# Altium project MDBU004A.PrjPcb
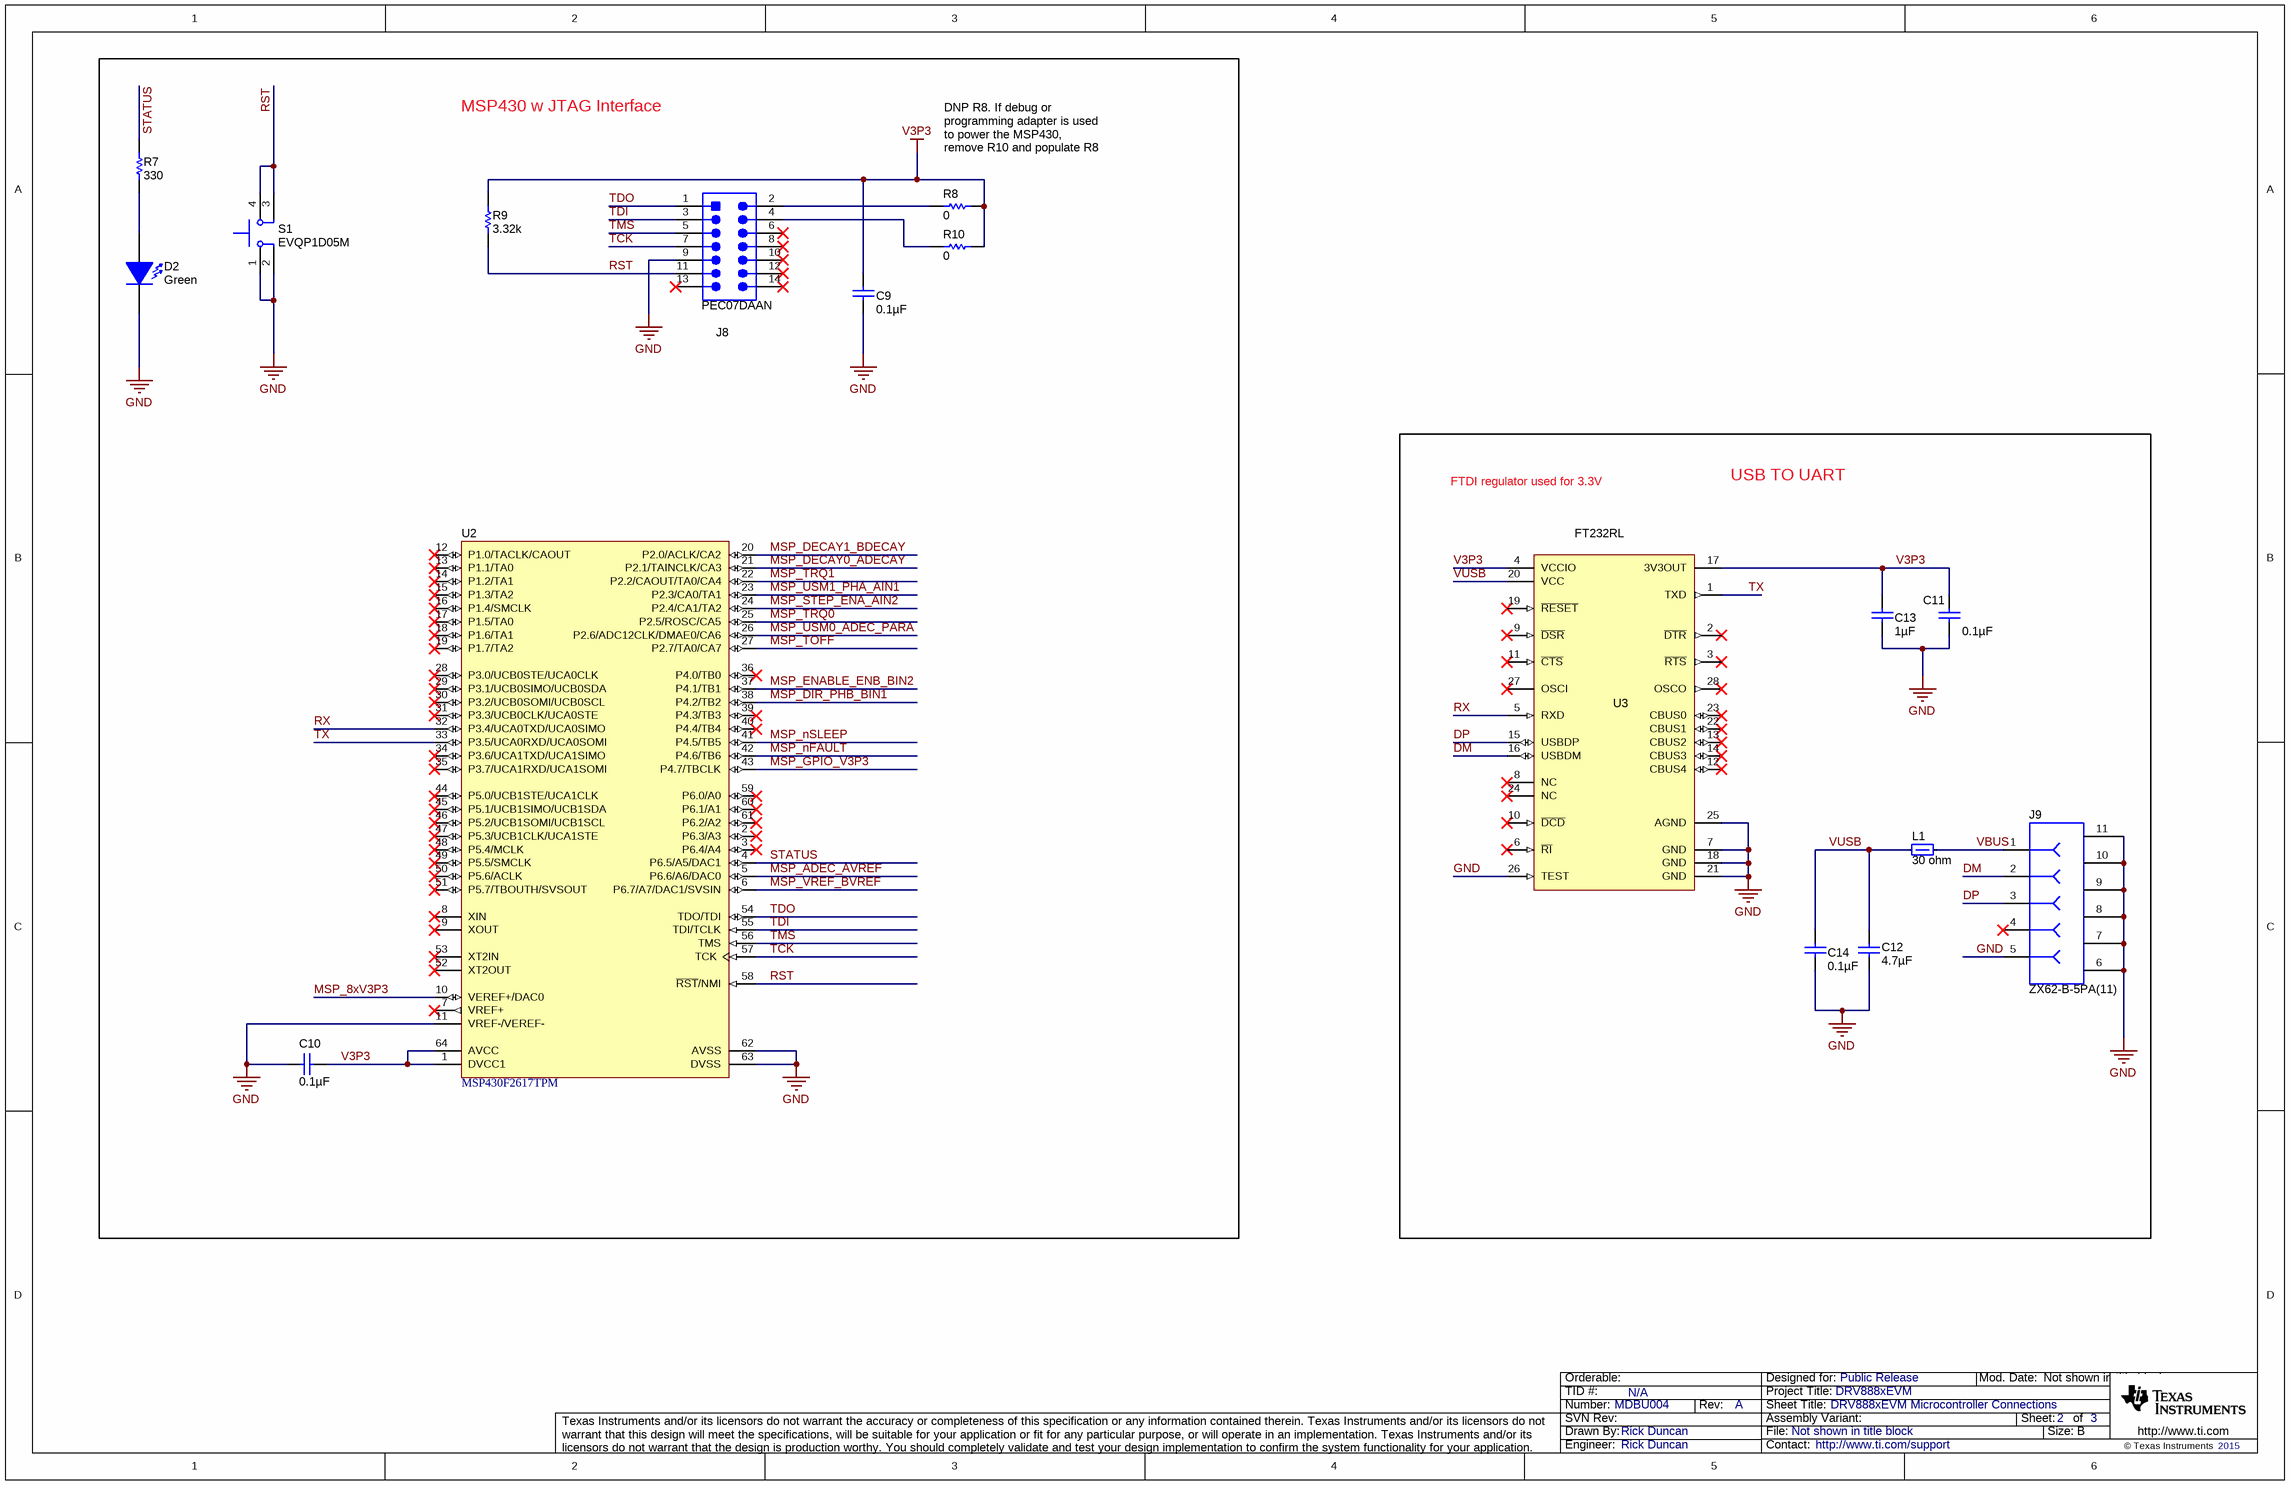
[diagram p0: MDBU004A_DRV888x_MSP430F2617.SchDoc]
CopyrightYear: 2015; PCB_Layout: Rick Duncan; PCB_Rev: A; PRJ_Customer: Public Release; PRJ_Engineer: Rick Duncan; PRJ_Number: MDBU004; PRJ_Title: DRV888xEVM; SCH_Rev: A; TechSupport: http://www.ti.com/support; TID: N/A
3 sheets, 61 parts. Net scope: global (net labels, ports and power ports of the same name join across sheets).
Board file: MDBU004A.PcbDoc
Sheets:
  MDBU004A_DRV888x_MSP430F2617.SchDoc
  MDBU004A_DRV888x.SchDoc
  MDBU004A_Hardware.SchDoc

## Sheet MDBU004A_DRV888x_MSP430F2617.SchDoc: DRV888xEVM Microcontroller Connections
size 431 x 279 mm; Date: Not shown in title block; ApprovedBy: Not shown in title block; CheckedBy: Not shown in title block; Author: Not shown in title block; CompanyName: Not shown in title block; DrawnBy: Rick Duncan; Engineer: Not shown in title block; Organization: Not shown in title block; Address1: Not shown in title block; Address2: Not shown in title block; Address3: Not shown in title block; Address4: Not shown in title block; DocumentNumber: 1; Revision: Use project parameter SCH_Rev; SheetNumber: 2; SheetTotal: 3; PageSetup: Record=PageOptions|CenterHorizontal=True|CenterVertical=True|PrintScale=1.00|XCorrection=1.00|YCorrection=1.00|PrintKind=0|BorderSize=5000000|LeftOffset=0|BottomOffset=0|Orientation=2|PaperLength=1000|PaperWidth=1000|Scale=100|PaperSource=15|PrintQuality=-3|MediaType=1|DitherType=10|PrintScaleMode=1|PaperKind=Letter|PaperIndex=1; CurrentTime: Not shown in title block; CurrentDate: Not shown in title block; Time: Not shown in title block; DocumentFullPathAndName: Not shown in title block; DocumentName: Not shown in title block; ModifiedDate: Not shown in title block; ImagePath: Not shown in title block

### Parts
C9  ValueDisplayed: 0.1µF  [0402L]  (hidden comment: GRM155R61A104KA01D)
C10  ValueDisplayed: 0.1µF  [0402L]  (hidden comment: GRM155R61A104KA01D)
C11  ValueDisplayed: 0.1µF  [0402L]  (hidden comment: GRM155R61A104KA01D)
C12  ValueDisplayed: 4.7µF  [0603L]  (hidden comment: CGB3B1X5R1A475K055AC)
C13  ValueDisplayed: 1µF  [0402L]  (hidden comment: GRM155R61A105KE15D)
C14  ValueDisplayed: 0.1µF  [0402L]  (hidden comment: GRM155R61A104KA01D)
D2  value Green  [LED_LTST-C190]  (hidden comment: LTST-C190GKT)
J8  PEC07DAAN  [CONN_PEC07DAAN]
J9  ZX62-B-5PA(11)  [CONN_USB_micro_ZX62-B-5PA]
L1  value 30 ohm  [0805L]  (hidden comment: MMZ2012R300A)
R7  value 330  [0402L]  (hidden comment: CRCW0402330RJNED)
R8  value 0  [0402L]  (hidden comment: ERJ-2GE0R00X)
R9  value 3.32k  [0402L]  (hidden comment: CRCW04023K32FKED)
R10  value 0  [0402L]  (hidden comment: ERJ-2GE0R00X)
S1  EVQP1D05M  [SW_EVQxxx05M]
U2  MSP430F2617TPM  [PM0064A_L]
U3  FT232RL  [SSOP28_M]

### Blocks framed on the sheet
MSP430 w JTAG Interface: C9 C10 D2 J8 R7-R10 S1 U2
USB TO UART: C11-C14 J9 L1 U3

### Nets
GND: C9.2 C10.2 C11.2 C12.2 C13.2 C14.2 D2.2(K) J8.9 J9.5 J9.6 J9.7 J9.8 J9.9 J9.10 J9.11 S1.1 S1.2 U2.11(VREF-/VEREF-) U2.62(AVSS) U2.63(DVSS) U3.7(GND) U3.18(GND) U3.21(GND) U3.25(AGND) U3.26(TEST)
V3P3: C9.1 C10.1 C11.1 C13.1 R8.1 R9.2 R10.1 U2.1(DVCC1) U2.64(AVCC) U3.4(VCCIO) U3.17(3V3OUT)
DM: J9.2 U3.16(USBDM)
DP: J9.3 U3.15(USBDP)
MSP_8xV3P3: U2.10(VEREF+/DAC0)
MSP_ADEC_AVREF: U2.5(P6.6/A6/DAC0)
MSP_DECAY0_ADECAY: U2.21(P2.1/TAINCLK/CA3)
MSP_DECAY1_BDECAY: U2.20(P2.0/ACLK/CA2)
MSP_DIR_PHB_BIN1: U2.38(P4.2/TB2)
MSP_ENABLE_ENB_BIN2: U2.37(P4.1/TB1)
MSP_GPIO_V3P3: U2.43(P4.7/TBCLK)
MSP_nFAULT: U2.42(P4.6/TB6)
MSP_nSLEEP: U2.41(P4.5/TB5)
MSP_STEP_ENA_AIN2: U2.24(P2.4/CA1/TA2)
MSP_TOFF: U2.27(P2.7/TA0/CA7)
MSP_TRQ0: U2.25(P2.5/ROSC/CA5)
MSP_TRQ1: U2.22(P2.2/CAOUT/TA0/CA4)
MSP_USM0_ADEC_PARA: U2.26(P2.6/ADC12CLK/DMAE0/CA6)
MSP_USM1_PHA_AIN1: U2.23(P2.3/CA0/TA1)
MSP_VREF_BVREF: U2.6(P6.7/A7/DAC1/SVSIN)
RST: J8.11 R9.1 S1.3 S1.4 U2.58(~{RST}/NMI)
RX: U2.32(P3.4/UCA0TXD/UCA0SIMO) U3.5(RXD)
STATUS: R7.2 U2.4(P6.5/A5/DAC1)
TCK: J8.7 U2.57(TCK)
TDI: J8.3 U2.55(TDI/TCLK)
TDO: J8.1 U2.54(TDO/TDI)
TMS: J8.5 U2.56(TMS)
TX: U2.33(P3.5/UCA0RXD/UCA0SOMI) U3.1(TXD)
VBUS: J9.1 L1.2
VUSB: C12.1 C14.1 L1.1 U3.20(VCC)
NetD2_1: D2.1(A) R7.1
NetJ8_2: J8.2 R8.2
NetJ8_4: J8.4 R10.2

Not connected (* = marked no-connect by the designer): J8 6* 8* 10* 12* 13* 14*; J9 4*; U2 2(P6.3/A3)* 3(P6.4/A4)* 7(VREF+)* 8(XIN)* 9(XOUT)* 12(P1.0/TACLK/CAOUT)* 13(P1.1/TA0)* 14(P1.2/TA1)* 15(P1.3/TA2)* 16(P1.4/SMCLK)* 17(P1.5/TA0)* 18(P1.6/TA1)* 19(P1.7/TA2)* 28(P3.0/UCB0STE/UCA0CLK)* 29(P3.1/UCB0SIMO/UCB0SDA)* 30(P3.2/UCB0SOMI/UCB0SCL)* 31(P3.3/UCB0CLK/UCA0STE)* 34(P3.6/UCA1TXD/UCA1SIMO)* 35(P3.7/UCA1RXD/UCA1SOMI)* 36(P4.0/TB0)* 39(P4.3/TB3)* 40(P4.4/TB4)* 44(P5.0/UCB1STE/UCA1CLK)* 45(P5.1/UCB1SIMO/UCB1SDA)* 46(P5.2/UCB1SOMI/UCB1SCL)* 47(P5.3/UCB1CLK/UCA1STE)* 48(P5.4/MCLK)* 49(P5.5/SMCLK)* 50(P5.6/ACLK)* 51(P5.7/TBOUTH/SVSOUT)* 52(XT2OUT)* 53(XT2IN)* 59(P6.0/A0)* 60(P6.1/A1)* 61(P6.2/A2)*; U3 2(~{DTR})* 3(~{RTS})* 6(~{RI})* 8(NC)* 9(~{DSR})* 10(~{DCD})* 11(~{CTS})* 12(CBUS4)* 13(CBUS2)* 14(CBUS3)* 19(~{RESET})* 22(CBUS1)* 23(CBUS0)* 24(NC)* 27(OSCI)* 28(OSCO)*

### Notes on the sheet
- (near R8) DNP R8. If debug or programming adapter is used to power the MSP430, remove R10 and populate R8
- FTDI regulator used for 3.3V
- Drawn By:
- SVN Rev:
- Number:
- TID #:
- Orderable:
- Rev:
- Sheet Title:
- File:
- Project Title:
- Designed for:
- Assembly Variant:
- Mod. Date:
- Sheet:
- Size:
- of
- B
- http://www.ti.com
- Texas Instruments and/or its licensors do not warrant the accuracy or completeness of this specification or any information contained therein. Texas Instruments and/or its licensors do not warrant that this design will meet the specifications, will be suitable for your application or fit for any particular purpose, or will operate in an implementation. Texas Instruments and/or its licensors do not warrant that the design is production worthy. You should completely validate and test your design implementation to confirm the system functionality for your application.
- Engineer:
- Contact:
- © Texas Instruments

### Library data of the parts
C9-C11 C14 = GRM155R61A104KA01D: CAP, CERM, 0.1 µF, 10 V, +/- 10%, X5R, 0402; Manufacturer: MuRata; Value: 0.1uF; Polarized: N; CompType: Capacitor; U/M: EA; Cap_F: 0.0000001; Tolerance_%: 10; Value1: Unknown; Value2: 10V; TaMin_C: -55; TaMax_C: 85; Cap_Case: 0402; SymbolVersion: 2008-07-09; PartNumber: GRM155R61A104KA01D; PackageReference: 0402; RoHS: Y; VDC_V: 10; MountType: SMT; Technology: Ceramic; TempCo: X5R; Published: 2008-06-19; Publisher: Texas Instruments; LatestRevisionDate: 2015-06-10; ComponentLink1Description: Datasheet link; ComponentLink1URL: http://search.murata.co.jp/Ceramy/PnsearchViewAction.do?HnOFG=ON&HnNFG=ON&SEL_CNT=50&sLang=en&sKey=GRM155R61A104KA01D&x=9&y=9&search=startwith; Supplier 1: Digi-Key; Supplier Part Number 1: 490-1318-1-ND; Supplier 2: Mouser; Supplier Part Number 2: 81-GRM155R61A104KA01; Supplier 3: Farnell; Supplier Part Number 3: 1828862
C12 = CGB3B1X5R1A475K055AC: CAP, CERM, 4.7 µF, 10 V, +/- 10%, X5R, 0603; Manufacturer: TDK; Polarized: N; CompType: Capacitor; Value: 4.7uF; U/M: EA; Cap_F: 0.0000047; Tolerance_%: 10; Value1: Unknown; Value2: 10V; TaMin_C: -55; TaMax_C: 85; Cap_Case: 0603; SymbolVersion: 2008-07-09; PartNumber: CGB3B1X5R1A475K055AC; PackageReference: 0603; RoHS: Y; VDC_V: 10; MountType: SMT; Technology: Ceramic; TempCo: X5R; Published: 2008-06-19; Publisher: Texas Instruments; LatestRevisionDate: 2015-06-10; ComponentLink1Description: Datasheet link; ComponentLink1URL: http://www.tdk.com/pdf/mlcc_product_guide_A12.pdf; Supplier 1: Digi-Key; Supplier Part Number 1: 445-7482-1-ND
C13 = GRM155R61A105KE15D: CAP, CERM, 1 µF, 10 V, +/- 10%, X5R, 0402; Manufacturer: MuRata; Value: 1uF; Polarized: N; CompType: Capacitor; U/M: EA; Cap_F: 0.000001; Tolerance_%: 10; Value1: Unknown; Value2: 10V; TaMin_C: -55; TaMax_C: 85; Cap_Case: 0402; SymbolVersion: 2008-07-09; PartNumber: GRM155R61A105KE15D; PackageReference: 0402; RoHS: Y; VDC_V: 10; MountType: SMT; Technology: Ceramic; TempCo: X5R; Published: 2008-06-19; Publisher: Texas Instruments; LatestRevisionDate: 2015-06-10; ComponentLink1Description: Datasheet link; ComponentLink1URL: http://search.murata.co.jp/Ceramy/PnsearchViewAction.do?HnOFG=ON&HnNFG=ON&SEL_CNT=50&sLang=en&sKey=GRM155R61A105KE15D&x=9&y=9&search=startwith; Supplier 1: Digi-Key; Supplier Part Number 1: 490-3890-1-ND; Supplier 2: Mouser; Supplier Part Number 2: 81-GRM155R61A105KE15; Supplier 3: Farnell; Supplier Part Number 3: 1735523
D2 = LTST-C190GKT: LED, Green, SMD; Manufacturer: Lite-On; Vf_V: 2.1; Value2: 2.1V; Io_A: 0.02; Power_TotalModule: 0.1; Value1: 0.1W; U/M: EA; PartNumber: LTST-C190GKT; SymbolVersion: 2008-12-08; PackageReference: 1.6x0.8x0.8mm; ComponentLink1URL: https://sps06.itg.ti.com/sites/KMS/crossdivteams/altium/docs/ComponentDatasheets/LTST-C190GKT.pdf; ComponentLink1Description: Datasheet link; Supplier 1: Digi-Key; Supplier Part Number 1: 160-1183-1-ND; MountType: SMT; CompType: LED; RoHS: Y; Type: ?; Color: green; Published: 2008-07-11; Publisher: Texas Instruments; LatestRevisionDate: 2015-06-04; Supplier 2: Mouser; Supplier Part Number 2: 859-LTST-C190GKT
J8 = PEC07DAAN: Header, 100mil, 7x2, Tin, TH; Manufacturer: Sullins Connector Solutions; SymbolCreator: a0412235; U/M: EA; SymbolVersion: 2013-12-22; PartNumber: PEC07DAAN; PackageReference: Header, 7x2, 100mil, Tin; CompType: Header; RoHS: Y; MountType: TH; ComponentLink1Description: Datasheet Link; ComponentLink1URL: http://www.sullinscorp.com/catalogs/97_Page78-79_HEADER_.100_2.54mm_MALE_BREAKAWAY.pdf; Publisher: Texas Instruments; LatestRevisionDate: 2015-06-02; Supplier 1: Digi-Key; Supplier Part Number 1: S2012E-07-ND; ClassName: Header
J9 = ZX62-B-5PA(11): Connector, Receptacle, Micro-USB Type B, R/A, Bottom Mount SMT; Manufacturer: Hirose Electric Co. Ltd.; SymbolCreator: a0411947; U/M: EA; SymbolVersion: 2013-04-05; PartNumber: ZX62-B-5PA(11); PackageReference: Micro USB-B receptacle; CompType: Receptacle; RoHS: Y; MountType: SMT; ComponentLink1Description: Datasheet Link; ComponentLink1URL: http://www.hirose.co.jp/cataloge_hp/e24200011.pdf; Publisher: Texas Instruments; LatestRevisionDate: 2015-06-10; Supplier 1: Digi-Key; Supplier Part Number 1: H11634CT-ND; Supplier 2: Mouser; Supplier Part Number 2: 798-ZX62-B-5PA11; Supplier 3: Farnell; Supplier Part Number 3: 1645325
L1 = MMZ2012R300A: Ferrite Bead, 30 ohm @ 100 MHz, 1.5 A, 0805; Manufacturer: TDK; Imax_A: 1.5; DCR_ohm: 0.05; Value1: 0.05 ohm; Value2: 1.5A; ZTyp@100MHz_Ohm: 30; ComponentLink1URL: http://www.tdk.co.jp/tefe02/e9412_mmz.pdf; PackageReference: 0805; SymbolVersion: 2009-06-02; PartNumber: MMZ2012R300A; ComponentLink1Description: Datasheet link; Supplier 1: Digi-Key; Supplier Part Number 1: 445-2199-1-ND; MountType: SMT; CompType: Ferrite Bead; Published: 2014-04-30; Publisher: Texas Instruments; LatestRevisionDate: 2015-06-08; RoHS: Y; Supplier 2: Mouser; Supplier Part Number 2: 810-MMZ2012R300A; Supplier 3: Farnell; Supplier Part Number 3: 1669723
R7 = CRCW0402330RJNED: RES, 330, 5%, 0.063 W, 0402; Manufacturer: Vishay-Dale; CompType: Resistor; Value_Code: 330R; Tolerance_%: 5; Power_W: 0.063; Value2: 0.063W; VDC_V: 50; TempCo: 200 ppm/C; EIA_Code: E24; U/M: EA; SymbolVersion: 2009-05-29; PartNumber: CRCW0402330RJNED; PackageReference: 0402; RoHS: Y; Res_ohm: 330; Value1: 5%; MountType: SMT; Technology: Thick Film; Published: 2008-06-26; Publisher: Texas Instruments; LatestRevisionDate: 2015-05-27; ComponentLink1Description: Datasheet link; ComponentLink1URL: http://www.vishay.com/docs/20035/dcrcwe3.pdf; Supplier 1: Digi-Key; Supplier Part Number 1: 541-330JCT-ND; Supplier 2: Mouser; Supplier Part Number 2: 71-CRCW0402J-330-E3; Supplier 3: Farnell; Supplier Part Number 3: 1514698; ValueDisplayed: 330
R8 R10 = ERJ-2GE0R00X: RES, 0, 5%, 0.063 W, 0402; Manufacturer: Panasonic; CompType: Resistor; Value_Code: 0000; Tolerance_%: 5; Power_W: 0.063; Value2: 0.063W; VDC_V: 50; TempCo: 600 ppm/C; EIA_Code: E24; U/M: EA; SymbolVersion: 2009-05-29; PartNumber: ERJ-2GE0R00X; PackageReference: 0402; RoHS: Y; Res_ohm: 0; Value1: 5%; MountType: SMT; Technology: Thick Film; Published: 2008-06-26; Publisher: Texas Instruments; LatestRevisionDate: 2015-05-27; ComponentLink1Description: Datasheet link; ComponentLink1URL: http://www.panasonic.com/industrial/components/pdf/AOA0000CE1.pdf; Supplier 1: Digi-Key; Supplier Part Number 1: P0.0JCT-ND; Supplier 2: Mouser; Supplier Part Number 2: 667-ERJ-2GE0R00X; Supplier 3: Farnell; Supplier Part Number 3: 2059190; ValueDisplayed: 0
R9 = CRCW04023K32FKED: RES, 3.32 k, 1%, 0.063 W, 0402; Manufacturer: Vishay-Dale; CompType: Resistor; Res_ohm: 3320; Value_Code: 3k32; Tolerance_%: 1; Power_W: 0.063; Value2: 0.063W; VDC_V: 50; TempCo: 100 ppm/C; EIA_Code: E96; U/M: EA; SymbolVersion: 2009-05-29; PartNumber: CRCW04023K32FKED; PackageReference: 0402; RoHS: Y; Value1: 1%; MountType: SMT; Technology: Thick Film; Published: 2008-06-26; Publisher: Texas Instruments; LatestRevisionDate: 2015-05-27; ComponentLink1Description: Datasheet link; ComponentLink1URL: http://www.vishay.com/docs/20035/dcrcwe3.pdf; Supplier 1: Digi-Key; Supplier Part Number 1: 541-3.32KLCT-ND; Supplier 2: Mouser; Supplier Part Number 2: 71-CRCW0402-3.32K-E3; Supplier 3: Farnell; Supplier Part Number 3: 1652792; ValueDisplayed: 3.32k
S1 = EVQP1D05M: Switch, Tactile, SPST-NO, 0.05A, 12V, SMT; Manufacturer: Panasonic; SymbolCreator: a0799628; VDC_V: 12; SwitchFunction: Off-Mom; PositionCount: 1; CurrentRating_mA: 50; SymbolVersion: 2013-10-28; PartNumber: EVQP1D05M; MountType: SMT; ComponentLink1Description: Datasheet URL; ComponentLink1URL: http://industrial.panasonic.com/www-data/pdf/ATK0000/ATK0000CE16.pdf; RoHS: Y; Circuit: SPST-NO; Orientation: Top Actuated; CompType: Switch; PackageReference: 6x5x6 mm; Publisher: Texas Instruments; LatestRevisionDate: 2015-06-10; Supplier 1: Digi-Key; Supplier Part Number 1: P10888SCT-ND; Supplier 2: Mouser; Supplier Part Number 2: 667-EVQ-P1D05M; Supplier 3: Farnell; Supplier Part Number 3: 2079569
U2 = MSP430F2617TPM: 16 MHz Mixed Signal Microcontroller with 92 KB Flash, 8192 B SRAM and 48 GPIOs, -40 to 105 degC, 64-pin QFP (PM), Green (RoHS & no Sb/Br); Manufacturer: Texas Instruments; Alternate PartNumber: Equivalent; ADC: 12-bit SAR; ADC Channels: 8; Brown Out Reset: Yes; DMA: 3; Flash(KB): 92; Frequency(MHz): 16; GPIO: 48; Multiplier: 16x16; Pin/Package: 64LQFP; SRAM(B): 8192; SubFamily: 2 Series, Extended Temp; Timers - 16-bit: 2; ComponentLink1URL: http://www.ti.com/; PackageReference: PM0064A; PartNumber: MSP430F2617TPM; Alternate Manufacturer: Texas Instruments; ComponentLink1Description: Manufacturer URL; MountType: SMT; DatasheetVersion: SLAS541K; PackageVersion: 0; PackageDescription: 64-Pin Plastic Flat Pack, Body 10 x 10 mm, Pitch 0.5 mm; Comparators: Yes; Eco-Plan: Green (RoHS & no Sb/Br); SVS: Yes; Temp Sensor: Yes; USCI_A (UART/LIN/IrDA/SPI): 2; USCI_B (I2C & SPI): 2; Watchdog: Yes; Code_JEDEC: MS-026; ComponentLink2Description: Datasheet; ComponentLink2URL: http://www.ti.com/general/docs/lit/getliterature.tsp?genericPartNumber=MSP430F2617&fileType=pdf
U3 = FT232RL: USB to Serial UART, SSOP28; Manufacturer: FTDI; SymbolCreator: x0208326; ComponentLink1URL: http://www.ftdichip.com/Support/Documents/DataSheets/ICs/DS_FT232R.pdf; PackageReference: SSOP28; PartNumber: FT232RL; SymbolVersion: 2014-03-03; ComponentLink1Description: Datasheet Link; Supplier 1: Digi-Key; Supplier Part Number 1: 768-1007-1-ND; MountType: SMT; RoHS: Y; Publisher: Texas Instruments; LatestRevisionDate: 2015-06-10; Supplier 2: Mouser; Supplier Part Number 2: 895-FT232RL; Supplier 3: Farnell; Supplier Part Number 3: 1146032

## Sheet MDBU004A_DRV888x.SchDoc: DRV888xEVM Motor Driver Connections
size 431 x 279 mm; Date: Not shown in title block; ApprovedBy: Not shown in title block; CheckedBy: Not shown in title block; Author: Not shown in title block; CompanyName: Not shown in title block; Engineer: Not shown in title block; Organization: Not shown in title block; Address1: Not shown in title block; Address2: Not shown in title block; Address3: Not shown in title block; Address4: Not shown in title block; DocumentNumber: 1; Revision: Use project parameter SCH_Rev; SheetNumber: 1; SheetTotal: 3; PageSetup: Record=PageOptions|CenterHorizontal=True|CenterVertical=True|PrintScale=1.00|XCorrection=1.00|YCorrection=1.00|PrintKind=0|BorderSize=5000000|LeftOffset=0|BottomOffset=0|Orientation=2|PaperLength=1000|PaperWidth=1000|Scale=100|PaperSource=15|PrintQuality=600|MediaType=1|DitherType=10|PaperKind=Letter|PrintScaleMode=1; CurrentTime: Not shown in title block; CurrentDate: Not shown in title block; Time: Not shown in title block; DocumentFullPathAndName: Not shown in title block; DocumentName: Not shown in title block; ModifiedDate: Not shown in title block; ImagePath: Not shown in title block
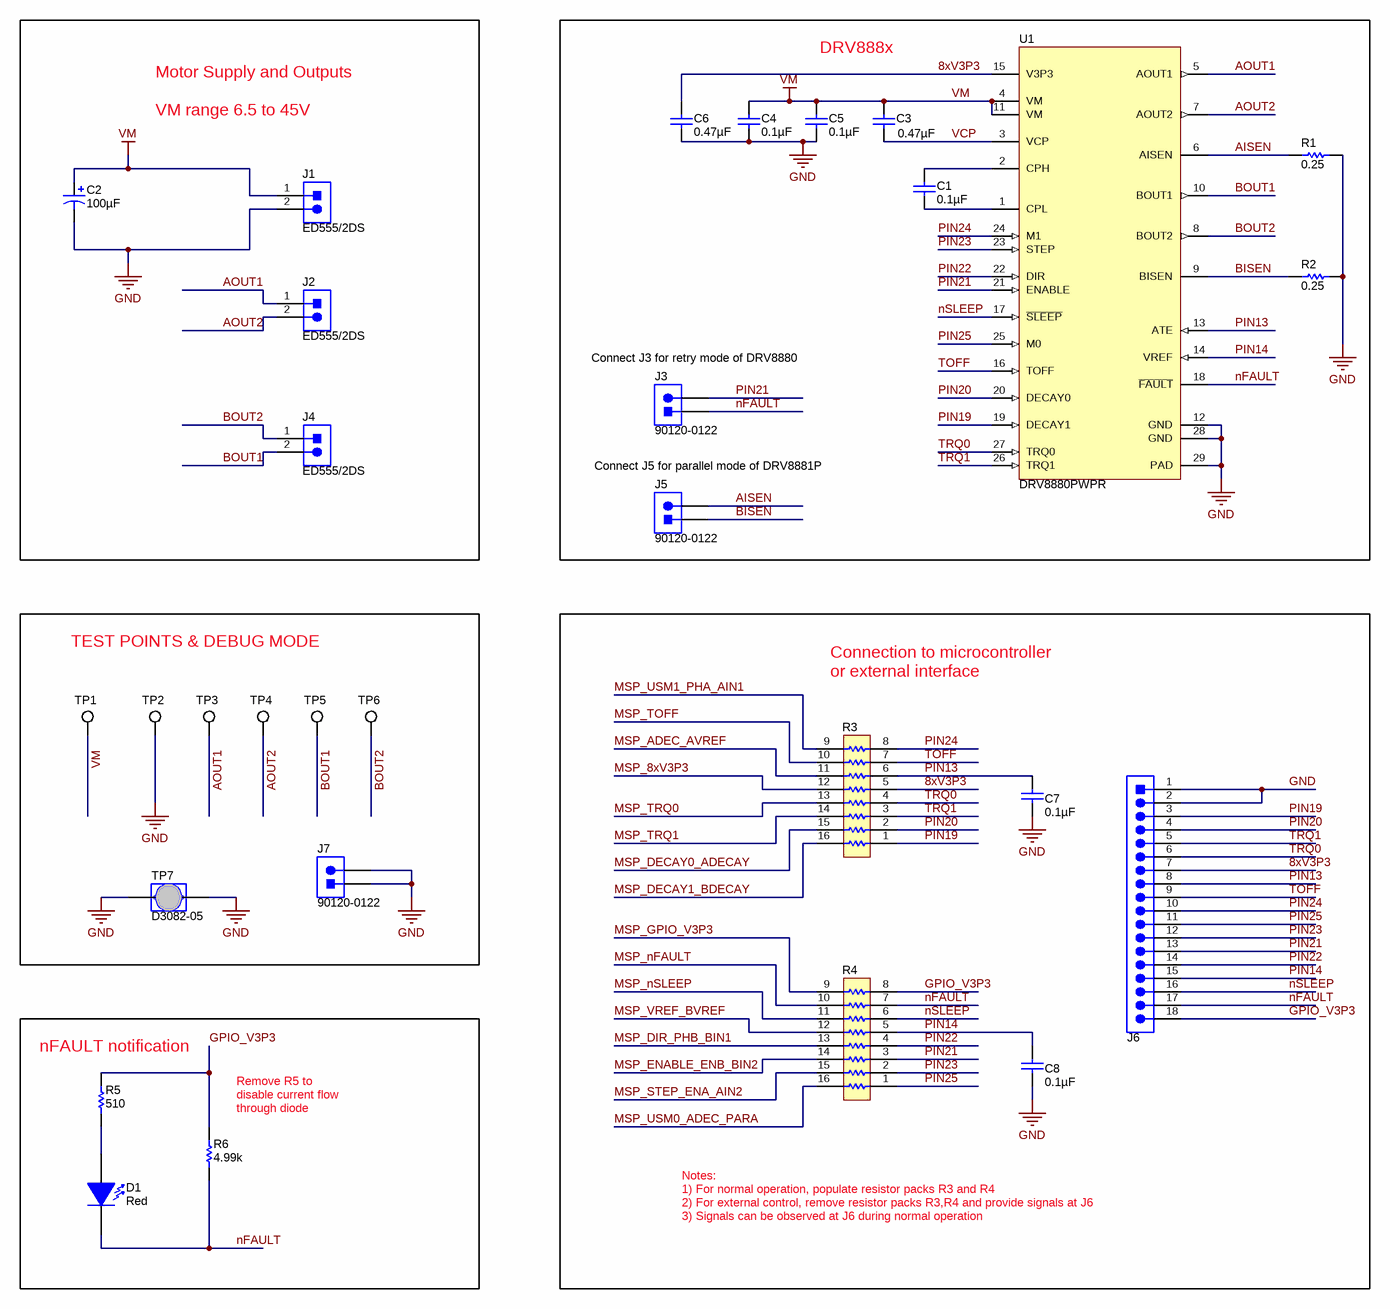
[diagram p1: MDBU004A_DRV888x.SchDoc]

### Parts
C1  ValueDisplayed: 0.1µF  [0805L]  (hidden comment: C0805C104K1RACTU)
C2  ValueDisplayed: 100µF  [SM_RADIAL_G]  (hidden comment: EEE-FK1J101P)
C3  ValueDisplayed: 0.47µF  [0805L]  (hidden comment: C2012X7R1E474K)
C4  ValueDisplayed: 0.1µF  [0805L]  (hidden comment: C0805C104K1RACTU)
C5  ValueDisplayed: 0.1µF  [0805L]  (hidden comment: C0805C104K1RACTU)
C6  ValueDisplayed: 0.47µF  [0603L]  (hidden comment: C0603C474K9RACTU)
C7  ValueDisplayed: 0.1µF  [0402L]  (hidden comment: GRM155R61A104KA01D)
C8  ValueDisplayed: 0.1µF  [0402L]  (hidden comment: GRM155R61A104KA01D)
D1  value Red  [LED_LTST-C190_Red]  (hidden comment: LTST-C190CKT)
J1  ED555/2DS  [TERM_BLK_ED555-2DS]
J2  ED555/2DS  [TERM_BLK_ED555-2DS]
J3  90120-0122  [CONN_90120-0122]
J4  ED555/2DS  [TERM_BLK_ED555-2DS]
J5  90120-0122  [CONN_90120-0122]
J6  TSW-118-07-G-S  [TSW-118-07-G-S]  (value not drawn)
J7  90120-0122  [CONN_90120-0122]
R1  value 0.25  [2010L]  (hidden comment: CSRN2010FKR250)
R2  value 0.25  [2010L]  (hidden comment: CSRN2010FKR250)
R3  EXB-2HV330JV  [RESCAXS_EXB-2HV]  (value not drawn)
R4  EXB-2HV330JV  [RESCAXS_EXB-2HV]  (value not drawn)
R5  value 510  [0402L]  (hidden comment: CRCW0402510RJNED)
R6  value 4.99k  [0402L]  (hidden comment: CRCW04024K99FKED)
TP1  5016  [Testpoint_Keystone_Compact]  (value not drawn)
TP2  5016  [Testpoint_Keystone_Compact]  (value not drawn)
TP3  5016  [Testpoint_Keystone_Compact]  (value not drawn)
TP4  5016  [Testpoint_Keystone_Compact]  (value not drawn)
TP5  5016  [Testpoint_Keystone_Compact]  (value not drawn)
TP6  5016  [Testpoint_Keystone_Compact]  (value not drawn)
TP7  D3082-05  [Harwin_D3082-05]
U1  DRV8880PWPR  [PWP0028C_N]

### Blocks framed on the sheet
DRV888x: C1 C3-C6 J3 J5 R1 R2 U1
TEST POINTS & DEBUG MODE: J7 TP1-TP7
nFAULT notification: D1 R5 R6

### Nets
GND: C2.2(-) C4.1 C5.1 C6.2 C7.2 C8.2 J1.2 J6.1 J6.2 J7.1 J7.2 R1.1 R2.1 TP2.1 TP7.1 TP7.2 U1.12(GND) U1.28(GND) U1.29(PAD)
VM: C2.1(+) C3.2 C4.2 C5.2 J1.1 TP1.1 U1.4(VM) U1.11(VM)
8xV3P3: C6.1 J6.7 R3.5 U1.15(V3P3)
AISEN: J5.2 R1.2 U1.6(AISEN)
AOUT1: J2.1 TP3.1 U1.5(AOUT1)
AOUT2: J2.2 TP4.1 U1.7(AOUT2)
BISEN: J5.1 R2.2 U1.9(BISEN)
BOUT1: J4.2 TP5.1 U1.10(BOUT1)
BOUT2: J4.1 TP6.1 U1.8(BOUT2)
GPIO_V3P3: J6.18 R4.8 R5.2 R6.2
MSP_8xV3P3: R3.12
MSP_ADEC_AVREF: R3.11
MSP_DECAY0_ADECAY: R3.15
MSP_DECAY1_BDECAY: R3.16
MSP_DIR_PHB_BIN1: R4.13
MSP_ENABLE_ENB_BIN2: R4.14
MSP_GPIO_V3P3: R4.9
MSP_nFAULT: R4.10
MSP_nSLEEP: R4.11
MSP_STEP_ENA_AIN2: R4.15
MSP_TOFF: R3.10
MSP_TRQ0: R3.13
MSP_TRQ1: R3.14
MSP_USM0_ADEC_PARA: R4.16
MSP_USM1_PHA_AIN1: R3.9
MSP_VREF_BVREF: R4.12
nFAULT: D1.2(K) J3.1 J6.17 R4.7 R6.1 U1.18(~{FAULT})
nSLEEP: J6.16 R4.6 U1.17(~{SLEEP})
PIN13: C7.1 J6.8 R3.6 U1.13(ATE)
PIN14: C8.1 J6.15 R4.5 U1.14(VREF)
PIN19: J6.3 R3.1 U1.19(DECAY1)
PIN20: J6.4 R3.2 U1.20(DECAY0)
PIN21: J3.2 J6.13 R4.3 U1.21(ENABLE)
PIN22: J6.14 R4.4 U1.22(DIR)
PIN23: J6.12 R4.2 U1.23(STEP)
PIN24: J6.10 R3.8 U1.24(M1)
PIN25: J6.11 R4.1 U1.25(M0)
TOFF: J6.9 R3.7 U1.16(TOFF)
TRQ0: J6.6 R3.4 U1.27(TRQ0)
TRQ1: J6.5 R3.3 U1.26(TRQ1)
VCP: C3.1 U1.3(VCP)
NetC1_1: C1.1 U1.1(CPL)
NetC1_2: C1.2 U1.2(CPH)
NetD1_1: D1.1(A) R5.1

### Notes on the sheet
- Motor Supply and Outputs
  VM range 6.5 to 45V
- (near J3) Connect J3 for retry mode of DRV8880
- Connect J5 for parallel mode of DRV8881P
- Connection to microcontroller
  or external interface
- (near R6) Remove R5 to disable current flow through diode
- Notes:
  1) For normal operation, populate resistor packs R3 and R4
  2) For external control, remove resistor packs R3,R4 and provide signals at J6
  3) Signals can be observed at J6 during normal operation
- Drawn By:
- SVN Rev:
- Number:
- TID #:
- Orderable:
- Rev:
- Sheet Title:
- File:
- Project Title:
- Designed for:
- Assembly Variant:
- Mod. Date:
- Sheet:
- Size:
- of
- B
- http://www.ti.com
- Texas Instruments and/or its licensors do not warrant the accuracy or completeness of this specification or any information contained therein. Texas Instruments and/or its licensors do not warrant that this design will meet the specifications, will be suitable for your application or fit for any particular purpose, or will operate in an implementation. Texas Instruments and/or its licensors do not warrant that the design is production worthy. You should completely validate and test your design implementation to confirm the system functionality for your application.
- Engineer:
- Contact:
- © Texas Instruments

### Library data of the parts
C1 C4 C5 = C0805C104K1RACTU: CAP, CERM, 0.1 µF, 100 V, +/- 10%, X7R, 0805; Manufacturer: Kemet; Polarized: N; CompType: Capacitor; Value: 0.1uF; U/M: EA; Cap_F: 0.0000001; Tolerance_%: 10; ESR_ohm: 0.064; Value1: 0.064 ohm; VDC_V: 100; Value2: 100V; IRMS_A: 1.64; TaMin_C: -55; TaMax_C: 125; Cap_Case: 0805; SymbolVersion: 2008-07-09; PartNumber: C0805C104K1RACTU; PackageReference: 0805; RoHS: Y; MountType: SMT; Technology: Ceramic; TempCo: X7R; Published: 2008-06-19; Publisher: Texas Instruments; LatestRevisionDate: 2015-06-10; ComponentLink1Description: Datasheet link; ComponentLink1URL: http://www.kemet.com/kemet/web/homepage/kechome.nsf/file/Partial%20Copy%20-%20Ceramic%20Surface%20Mount%20Capacitors/$file/F3102_CE.pdf; Supplier 1: Digi-Key; Supplier Part Number 1: 399-3486-1-ND; Supplier 2: Mouser; Supplier Part Number 2: 80-C0805C104K1R; Supplier 3: Farnell; Supplier Part Number 3: 1650862
C2 = EEE-FK1J101P: CAP, AL, 100 µF, 63 V, +/- 20%, 0.35 ohm, SMD; Manufacturer: Panasonic; Value: 100uF; Polarized: Y; CompType: Capacitor; U/M: EA; Cap_F: 0.0001; Tolerance_%: 20; ESR_ohm: 0.35; VDC_V: 63; Value2: 63V; IRMS_A: 0.4; TaMin_C: -55; TaMax_C: 105; Cap_Case: G; SymbolVersion: 2008-07-09; PartNumber: EEE-FK1J101P; PackageReference: SMT Radial G; RoHS: Y; Value1: 0.35 ohm; MountType: SMT; Technology: AL; Publisher: Texas Instruments; LatestRevisionDate: 2015-06-10; ComponentLink1Description: Datasheet link; ComponentLink1URL: http://www.panasonic.com/industrial/components/pdf/smt_aec_050505.pdf; Supplier 1: Digi-Key; Supplier Part Number 1: PCE3819CT-ND; Supplier 2: Mouser; Supplier Part Number 2: 667-EEE-FK1J101P; Supplier 3: Farnell; Supplier Part Number 3: 9696040; Series: FK
C3 = C2012X7R1E474K: CAP, CERM, 0.47 µF, 25 V, +/- 10%, X7R, 0805; Manufacturer: TDK; Polarized: N; CompType: Capacitor; Value: 0.47uF; U/M: EA; Cap_F: 0.00000047; Tolerance_%: 10; ESR_ohm: 0.0101; Value1: 0.0101 ohm; VDC_V: 25; Value2: 25V; TaMin_C: -55; TaMax_C: 125; Cap_Case: 0805; SymbolVersion: 2008-07-09; PartNumber: C2012X7R1E474K; PackageReference: 0805; RoHS: Y; MountType: SMT; Technology: Ceramic; TempCo: X7R; Published: 2008-06-19; Publisher: Texas Instruments; LatestRevisionDate: 2015-06-10; ComponentLink1Description: Datasheet link; ComponentLink1URL: http://www.tdk.co.jp/tefe02/e412_c.pdf; Supplier 1: Digi-Key; Supplier Part Number 1: 445-1353-1-ND; Supplier 2: Farnell; Supplier Part Number 2: 1844282
C6 = C0603C474K9RACTU: CAP, CERM, 0.47 µF, 6.3 V, +/- 10%, X7R, 0603; Manufacturer: Kemet; Polarized: N; CompType: Capacitor; Value: 0.47uF; U/M: EA; Cap_F: 0.00000047; Tolerance_%: 10; Value1: Unknown; VDC_V: 6.3; Value2: 6.3V; TaMin_C: -55; TaMax_C: 125; Cap_Case: 0603; SymbolVersion: 2008-07-09; PartNumber: C0603C474K9RACTU; PackageReference: 0603; RoHS: Y; MountType: SMT; Technology: Ceramic; TempCo: X7R; Published: 2008-06-19; Publisher: Texas Instruments; LatestRevisionDate: 2015-06-10; ComponentLink1Description: Datasheet link; ComponentLink1URL: http://www.kemet.com/kemet/web/homepage/kechome.nsf/vapubfiles/F3102_Y5V.pdf/$file/F3102_Y5V.pdf; Supplier 1: Digi-Key; Supplier Part Number 1: 399-4924-1-ND; Supplier 2: Mouser; Supplier Part Number 2: 80-C0603C474K9R
C7 C8 = GRM155R61A104KA01D: as C9 on sheet MDBU004A_DRV888x_MSP430F2617; SymbolVersion: 2008-07-09; PartNumber: GRM155R61A104KA01D; PackageReference: 0402; RoHS: Y; VDC_V: 10; MountType: SMT; Technology: Ceramic; TempCo: X5R; Published: 2008-06-19; Publisher: Texas Instruments; LatestRevisionDate: 2015-06-10; ComponentLink1Description: Datasheet link; ComponentLink1URL: http://search.murata.co.jp/Ceramy/PnsearchViewAction.do?HnOFG=ON&HnNFG=ON&SEL_CNT=50&sLang=en&sKey=GRM155R61A104KA01D&x=9&y=9&search=startwith; Supplier 1: Digi-Key; Supplier Part Number 1: 490-1318-1-ND; Supplier 2: Mouser; Supplier Part Number 2: 81-GRM155R61A104KA01; Supplier 3: Farnell; Supplier Part Number 3: 1828862
D1 = LTST-C190CKT: LED, Red, SMD; Manufacturer: Lite-On; Vf_V: 2; Value2: 2V; Io_A: 0.02; Tjmax_C: 85; Power_TotalModule: 0.0625; Value1: 0.0625W; U/M: EA; ComponentLink1URL: http://optoelectronics.liteon.com/en-us/api/DwonloadFileHandler.ashx?txtSpecNo=DS-22-98-0009&txtPartNo=LTST-C190CKT; SymbolVersion: 2008-12-08; PackageReference: Red LED, 1.6x0.8x0.8mm; PartNumber: LTST-C190CKT; ComponentLink1Description: Datasheet link; Supplier 1: Digi-Key; Supplier Part Number 1: 160-1181-1-ND; MountType: SMT; CompType: LED; RoHS: Y; Type: ?; Color: red; Published: 2008-07-11; Publisher: Texas Instruments; LatestRevisionDate: 2015-06-04; Supplier 2: Mouser; Supplier Part Number 2: 859-LTST-C190CKT
J1 J2 J4 = ED555/2DS: Terminal Block, 6A, 3.5mm Pitch, 2-Pos, TH; Manufacturer: On-Shore Technology; SymbolCreator: a0412235; CompType: Connector; U/M: EA; ComponentLink1URL: http://on-shore.com/sites/default/files/manuals/ed555ds.pdf; SymbolVersion: 2013-10-31; PackageReference: 7.0x8.2x6.5mm; PartNumber: ED555/2DS; ComponentLink1Description: Datasheet Link; RoHS: Y; MountType: TH; Publisher: Texas Instruments; LatestRevisionDate: 2015-06-10; Supplier 1: Digi-Key; Supplier Part Number 1: ED1514-ND
J3 J5 J7 = 90120-0122: Header, 100mil, 2x1, Tin, TH; Manufacturer: Molex; SymbolCreator: a0412235; U/M: EA; SymbolVersion: 2013-10-31; PartNumber: 90120-0122; PackageReference: Header 2x1; CompType: Header; RoHS: Y; MountType: TH; ComponentLink1Description: Datasheet Link; ComponentLink1URL: http://www.molex.com/pdm_docs/sd/901200122_sd.pdf; Publisher: Texas Instruments; LatestRevisionDate: 2015-06-11; Supplier 1: Digi-Key; Supplier Part Number 1: WM8072-ND; Supplier 2: Mouser; Supplier Part Number 2: 538-90120-0122; Supplier 3: Newark; Supplier Part Number 3: 19M8215; ClassName: Header
J6 = TSW-118-07-G-S: Header, 100mil, 18x1, Gold, TH; Manufacturer: Samtec; SymbolCreator: a0411947; U/M: EA; ComponentLink1URL: http://samtec.com/ftppub/pdf/TSW_TH.PDF; SymbolVersion: 2013-12-22; PackageReference: 18x1 Header; PartNumber: TSW-118-07-G-S; ComponentLink1Description: Datasheet Link; Supplier 1: Digi-Key; Supplier Part Number 1: SAM1029-18-ND; MountType: TH; ClassName: Header; CompType: Header; RoHS: Y; Publisher: Texas Instruments; LatestRevisionDate: 2015-06-08
R1 R2 = CSRN2010FKR250: RES, 0.25, 1%, 1 W, 2010; Manufacturer: Stackpole Electronics Inc; CompType: Resistor; Value_Code: R250; Tolerance_%: 1; Value2: 1W; TempCo: 250 ppm/C; U/M: EA; SymbolVersion: 2009-05-29; PartNumber: CSRN2010FKR250; PackageReference: 2010; RoHS: Y; Res_ohm: 0.25; Value1: 1%; Power_W: 1; MountType: SMT; Technology: Thick Film; Published: 2008-06-26; Publisher: Texas Instruments; LatestRevisionDate: 2015-04-13; ComponentLink1Description: Datasheet link; ComponentLink1URL: http://www.seielect.com/Catalog/SEI-csr.pdf; Supplier 1: Digi-Key; Supplier Part Number 1: CSRN2010FKR250CT-ND; ValueDisplayed: 0.25
R3 R4 = EXB-2HV330JV: RES, 33, 5%, 0.0625 W, Resistor Array - 8x1; Manufacturer: Panasonic; SymbolCreator: a0411947; Res_ohm: 33; Value: 33; Value_Code: 33R0; Tolerance_%: 5; Power_W: 0.0625; TempCo: 200 ppm/C; EIA_Code: E24; U/M: EA; SymbolVersion: 2013-05-25; PartNumber: EXB-2HV330JV; PackageReference: Resistor Array - 8x1; RoHS: Y; CompType: Resistor; Value1: 5%; Value2: 0.0625W; MountType: SMT; Technology: Thick Film; Published: 2008-06-26; Publisher: Texas Instruments; LatestRevisionDate: 2015-06-01; ComponentLink1Description: Datasheet link; ComponentLink1URL: http://industrial.panasonic.com/www-data/pdf/AOC0000/AOC0000CE1.pdf; Supplier 1: Digi-Key; Supplier Part Number 1: Y1330CT-ND; Supplier 2: Mouser; Supplier Part Number 2: 667-EXB-2HV330JV; Supplier 3: Farnell; Supplier Part Number 3: 2060066; ValueDisplayed: 33
R5 = CRCW0402510RJNED: RES, 510, 5%, 0.063 W, 0402; Manufacturer: Vishay-Dale; CompType: Resistor; Value_Code: 510R; Tolerance_%: 5; Power_W: 0.063; Value2: 0.063W; VDC_V: 50; TempCo: 200 ppm/C; EIA_Code: E24; U/M: EA; SymbolVersion: 2009-05-29; PartNumber: CRCW0402510RJNED; PackageReference: 0402; RoHS: Y; Res_ohm: 510; Value1: 5%; MountType: SMT; Technology: Thick Film; Published: 2008-06-26; Publisher: Texas Instruments; LatestRevisionDate: 2015-05-27; ComponentLink1Description: Datasheet link; ComponentLink1URL: http://www.vishay.com/docs/20035/dcrcwe3.pdf; Supplier 1: Digi-Key; Supplier Part Number 1: 541-510JCT-ND; Supplier 2: Mouser; Supplier Part Number 2: 71-CRCW0402J-510-E3; Supplier 3: Farnell; Supplier Part Number 3: 1570682; ValueDisplayed: 510
R6 = CRCW04024K99FKED: RES, 4.99 k, 1%, 0.063 W, 0402; Manufacturer: Vishay-Dale; CompType: Resistor; Res_ohm: 4990; Value_Code: 4k99; Tolerance_%: 1; Power_W: 0.063; Value2: 0.063W; VDC_V: 50; TempCo: 100 ppm/C; EIA_Code: E96; U/M: EA; SymbolVersion: 2009-05-29; PartNumber: CRCW04024K99FKED; PackageReference: 0402; RoHS: Y; Value1: 1%; MountType: SMT; Technology: Thick Film; Published: 2008-06-26; Publisher: Texas Instruments; LatestRevisionDate: 2015-05-27; ComponentLink1Description: Datasheet link; ComponentLink1URL: http://www.vishay.com/docs/20035/dcrcwe3.pdf; Supplier 1: Digi-Key; Supplier Part Number 1: 541-4.99KLCT-ND; Supplier 2: Mouser; Supplier Part Number 2: 71-CRCW0402-4.99K-E3; Supplier 3: Farnell; Supplier Part Number 3: 1469715; ValueDisplayed: 4.99k
TP1-TP6 = 5016: Test Point, Compact, SMT; Manufacturer: Keystone; CompType: Test Point Loop; U/M: EA; SymbolVersion: 2008-04-04; PartNumber: 5016; Value: SMT; RoHS: Y; PackageReference: Testpoint_Keystone_Compact; MountType: SMT; ComponentLink1Description: Datasheet Link; ComponentLink1URL: http://www.keyelco.com/userAssets/store/files/5016.PDF; Publisher: Texas Instruments; LatestRevisionDate: 2015-05-13; Supplier 1: Digi-Key; Supplier Part Number 1: 5016KCT-ND
TP7 = D3082-05: 1mm Uninsulated Shorting Plug, 10.16mm spacing, TH; Manufacturer: Harwin; SymbolCreator: a0799628; CompType: Jumper Wire; U/M: EA; SymbolVersion: 2014-05-16; MountType: TH; RoHS: Y; PartNumber: D3082-05; PackageReference: Shorting Plug, 10.16mm spacing, TH; ComponentLink1Description: Datasheet Link; ComponentLink1URL: http://cdn.harwin.com/pdfs/D3080-D3083.pdf; Supplier 1: Digi-Key; Supplier 2: Mouser; Supplier Part Number 1: 952-1873-ND; Supplier Part Number 2: 855-D3082-05; Publisher: Texas Instruments; LatestRevisionDate: 2015-06-10
U1 = DRV8880PWPR: 2-A 45-V 1/16-μstep Stepper Motor Driver With AutoTune, PWP0028C; Manufacturer: Texas Instruments; SymbolCreator: Altium; CompType: IC; U/M: EA; SymbolVersion: 2015-05-04; PartNumber: DRV8880PWPR; Alternate PartNumber: DRV8880PWP; PackageReference: PWP0028C; MountType: SMT; ComponentLink1Description: Datasheet Link; ComponentLink1URL: https://sps06.itg.ti.com/sites/KMS/crossdivteams/altium/docs/ComponentDatasheets/SLVSD18_060515.pdf; Publisher: Texas Instruments; LatestRevisionDate: 2015-06-11; Alternate Manufacturer: Texas Instruments

## Sheet MDBU004A_Hardware.SchDoc: DRV888xEVM Hardware and Notes
size 431 x 279 mm; Date: Not shown in title block; ApprovedBy: Not shown in title block; CheckedBy: Not shown in title block; Author: Not shown in title block; CompanyName: Not shown in title block; DrawnBy: Rick Duncan; Engineer: Not shown in title block; Organization: Not shown in title block; Address1: Not shown in title block; Address2: Not shown in title block; Address3: Not shown in title block; Address4: Not shown in title block; DocumentNumber: 1; Revision: Use project parameter SCH_Rev; SheetNumber: 3; SheetTotal: 3; PageSetup: Record=PageOptions|CenterHorizontal=True|CenterVertical=True|PrintScale=1.00|XCorrection=1.00|YCorrection=1.00|PrintKind=0|BorderSize=5000000|LeftOffset=0|BottomOffset=0|Orientation=2|PaperLength=1000|PaperWidth=1000|Scale=100|PaperSource=15|PrintQuality=600|MediaType=1|DitherType=10|PaperKind=Letter|PrintScaleMode=1; CurrentTime: Not shown in title block; CurrentDate: Not shown in title block; Time: Not shown in title block; DocumentFullPathAndName: Not shown in title block; DocumentName: Not shown in title block; ModifiedDate: Not shown in title block; ImagePath: Not shown in title block
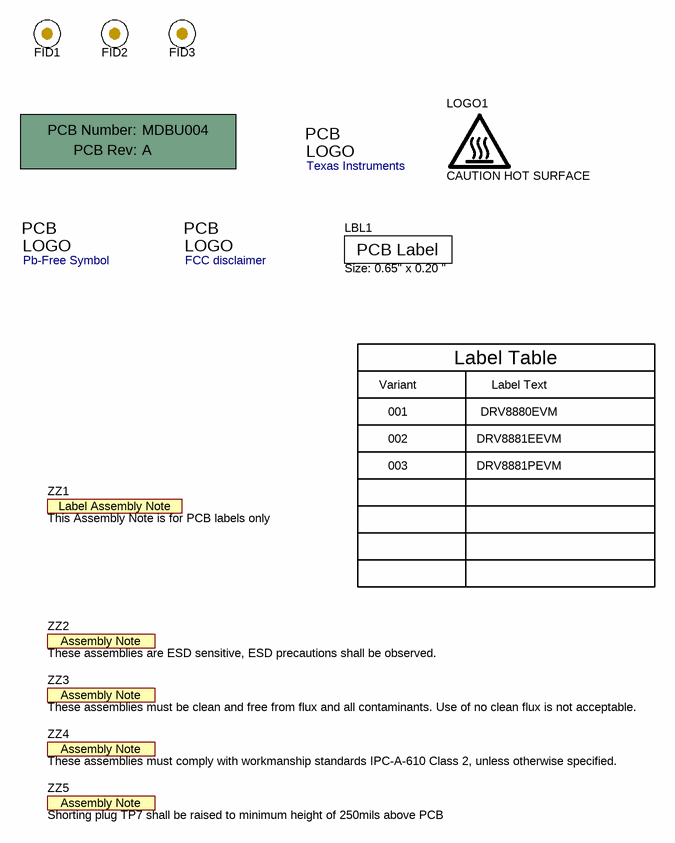
[diagram p2: MDBU004A_Hardware.SchDoc]

### Parts
!PCB1  Printed Circuit Board  (value not drawn)  (mechanical)
FID1  Fiducial  [Fiducial10-20]  (value not drawn)
FID2  Fiducial  [Fiducial10-20]  (value not drawn)
FID3  Fiducial  [Fiducial10-20]  (value not drawn)
LBL1  Size: 0.65" x 0.20 "  [Label_650x200]
LOGO1  CAUTION HOT SURFACE  [IEC_HotSurface_Small]  (no BOM)
Logo2  Texas Instruments  [TI_Symbol_Overlay_Small]  (no BOM)
Logo3  Pb-Free Symbol  [Pb-Free_Overlay_Medium]  (no BOM)
Logo4  FCC disclaimer  [FCC_disclaimer_stacked]  (no BOM)
ZZ1  This Assembly Note is for PCB labels only  [AssemblyNoteLabel]  (no BOM)
ZZ2  These assemblies are ESD sensitive, ESD precautions shall be observed.  [AssemblyNote]  (no BOM)
ZZ3  These assemblies must be clean and free from flux and all contaminants. Use of no clean flux is not acceptable.  [AssemblyNote]  (no BOM)
ZZ4  These assemblies must comply with workmanship standards IPC-A-610 Class 2, unless otherwise specified.  [AssemblyNote]  (no BOM)
ZZ5  Shorting plug TP7 shall be raised to minimum height of 250mils above PCB  [AssemblyNote]  (no BOM)

### Notes on the sheet
- Variant
- 001
- Label Table
- Label Text
- DRV8880EVM
- 002
- 003
- DRV8881EEVM
- DRV8881PEVM
- Drawn By:
- SVN Rev:
- Number:
- TID #:
- Orderable:
- Rev:
- Sheet Title:
- File:
- Project Title:
- Designed for:
- Assembly Variant:
- Mod. Date:
- Sheet:
- Size:
- of
- B
- http://www.ti.com
- Texas Instruments and/or its licensors do not warrant the accuracy or completeness of this specification or any information contained therein. Texas Instruments and/or its licensors do not warrant that this design will meet the specifications, will be suitable for your application or fit for any particular purpose, or will operate in an implementation. Texas Instruments and/or its licensors do not warrant that the design is production worthy. You should completely validate and test your design implementation to confirm the system functionality for your application.
- Engineer:
- Contact:
- © Texas Instruments
- (in symbol AssemblyNote) Assembly Note
- (in symbol AssemblyNoteLabel) Label Assembly Note
- (in symbol FCC_disclaimer) PCB; LOGO
- (in symbol Pb-Free) PCB; LOGO
- (in symbol PCB) PCB Number:; PCB Rev:
- (in symbol THT-14-423-10) PCB Label
- (in symbol TI_Logo) PCB; LOGO

### Library data of the parts
!PCB1 = PCB: Manufacturer: Any; PartNumber: MDBU004; SymbolCreator: a0412235; SymbolVersion: 2012-05-30; CompType: PCB; RoHS: O; MountType: N/A; Publisher: Texas Instruments; LatestRevisionDate: 2015-06-11
FID1-FID3 = Fiducial: Fiducial mark.  There is nothing to buy or mount.; SymbolCreator: codlsc; SymbolVersion: 2009-11-4; CompType: Fiducial; Publisher: Texas Instruments; LatestRevisionDate: 2015-06-01; LatestRevisionNote: Added Alternate PartNumber and Alternate Manufacturer parameters to appropriate components.; Manufacturer: N/A; MountType: N/A; PackageReference: N/A; PartNumber: N/A; ClassName: FiducialMark
LBL1 = THT-14-423-10: Thermal Transfer Printable Labels, 0.650" W x 0.200" H - 10,000 per roll; Manufacturer: Brady; SymbolCreator: a0412235; CompType: Label; SymbolVersion: 2012-06-12; ClassName: Label; PartNumber: THT-14-423-10; RoHS: Y; PackageReference: PCB Label 0.650"H x 0.200"W; MountType: N/A; ComponentLink1Description: Web Page; ComponentLink1URL: http://www.bradyid.com/bradyid/pdpv/THT-14-423-10.html; Note: Size: 0.65" x 0.20 "; Publisher: Texas Instruments; LatestRevisionDate: 2015-06-11; Supplier 1: Farnell; Supplier Part Number 1: 2065596; Supplier 2: Newark; Supplier Part Number 2: 97C5133
LOGO1 = IEC_HotSurface: IEC 61010-1 Hot Surface Warning; SymbolCreator: a0412235; SymbolVersion: 2011-08-22; Published: 2009-03-03; Publisher: Texas Instruments; LatestRevisionDate: 2014-11-20
Logo2 = TI_Logo: Texas Instrument Corporate Signature; SymbolCreator: a0412235; SymbolVersion: 2011-08-22; Published: 2009-03-03; Publisher: Texas Instruments; ClassName: Logo; LatestRevisionDate: 2014-11-20
Logo3 = Pb-Free: SymbolCreator: a0412235; SymbolVersion: 2011-08-22; Published: 2009-03-03; Publisher: Texas Instruments; LatestRevisionDate: 2014-11-20
Logo4 = FCC_disclaimer: SymbolCreator: codlsc; SymbolVersion: 2011-08-22; Published: 2009-03-03; Publisher: Texas Instruments; LatestRevisionDate: 2014-11-20
ZZ1 = AssemblyNoteLabel: SymbolCreator: a0412235; SymbolVersion: 2012-06-14; CompType: AssemblyNote; ClassName: AssemblyNote; Publisher: Texas Instruments; LatestRevisionDate: 2015-06-11
ZZ2-ZZ5 = AssemblyNote: SymbolCreator: codlsc; SymbolVersion: 2010-05-18; CompType: AssemblyNote; ClassName: AssemblyNote; Publisher: Texas Instruments
  ZZ2-ZZ4: LatestRevisionDate: 2012-06-14; LatestRevisionNote: Initial Version; Alternate Manufacturer: -; Alternate PartNumber: -
  ZZ5: LatestRevisionDate: 2015-06-11

## Nets that join several sheets
GND: MDBU004A_DRV888x_MSP430F2617 (25 pins), MDBU004A_DRV888x (19 pins)
MSP_8xV3P3: MDBU004A_DRV888x_MSP430F2617 (U2.10), MDBU004A_DRV888x (R3.12)
MSP_ADEC_AVREF: MDBU004A_DRV888x_MSP430F2617 (U2.5), MDBU004A_DRV888x (R3.11)
MSP_DECAY0_ADECAY: MDBU004A_DRV888x_MSP430F2617 (U2.21), MDBU004A_DRV888x (R3.15)
MSP_DECAY1_BDECAY: MDBU004A_DRV888x_MSP430F2617 (U2.20), MDBU004A_DRV888x (R3.16)
MSP_DIR_PHB_BIN1: MDBU004A_DRV888x_MSP430F2617 (U2.38), MDBU004A_DRV888x (R4.13)
MSP_ENABLE_ENB_BIN2: MDBU004A_DRV888x_MSP430F2617 (U2.37), MDBU004A_DRV888x (R4.14)
MSP_GPIO_V3P3: MDBU004A_DRV888x_MSP430F2617 (U2.43), MDBU004A_DRV888x (R4.9)
MSP_nFAULT: MDBU004A_DRV888x_MSP430F2617 (U2.42), MDBU004A_DRV888x (R4.10)
MSP_nSLEEP: MDBU004A_DRV888x_MSP430F2617 (U2.41), MDBU004A_DRV888x (R4.11)
MSP_STEP_ENA_AIN2: MDBU004A_DRV888x_MSP430F2617 (U2.24), MDBU004A_DRV888x (R4.15)
MSP_TOFF: MDBU004A_DRV888x_MSP430F2617 (U2.27), MDBU004A_DRV888x (R3.10)
MSP_TRQ0: MDBU004A_DRV888x_MSP430F2617 (U2.25), MDBU004A_DRV888x (R3.13)
MSP_TRQ1: MDBU004A_DRV888x_MSP430F2617 (U2.22), MDBU004A_DRV888x (R3.14)
MSP_USM0_ADEC_PARA: MDBU004A_DRV888x_MSP430F2617 (U2.26), MDBU004A_DRV888x (R4.16)
MSP_USM1_PHA_AIN1: MDBU004A_DRV888x_MSP430F2617 (U2.23), MDBU004A_DRV888x (R3.9)
MSP_VREF_BVREF: MDBU004A_DRV888x_MSP430F2617 (U2.6), MDBU004A_DRV888x (R4.12)

## Assembly variants
001: not fitted FID1 FID2 FID3 J5
002: not fitted FID1 FID2 FID3 J3 J5 J7; alternate parts U1 -> DRV8881EPWPR
003: not fitted FID1 FID2 FID3 J3; alternate parts U1 -> DRV8881PPWPR